# Altium schematic sheet 1_POWER.schdoc
size 307 x 218 mm; Symbol: A4空白; Device: A4空白; @Project Name: 34567890; @Page Count: 7; @Update Date: 2025-05-12; @Create Date: 2025-03-11; @Schematic Name: Schematic1; @Page No: 1; @Page Name: POWER; @Create Time: 07:05:34; @Board Name: PCB; @Update Time: 12:26:28; Title Block Position: 3; Width: 1170; Height: 825; Region Start: 1; X Region Count: 6; Y Region Count: 4; Blade Width: 10; SheetNumber: 1; SheetTotal: 7
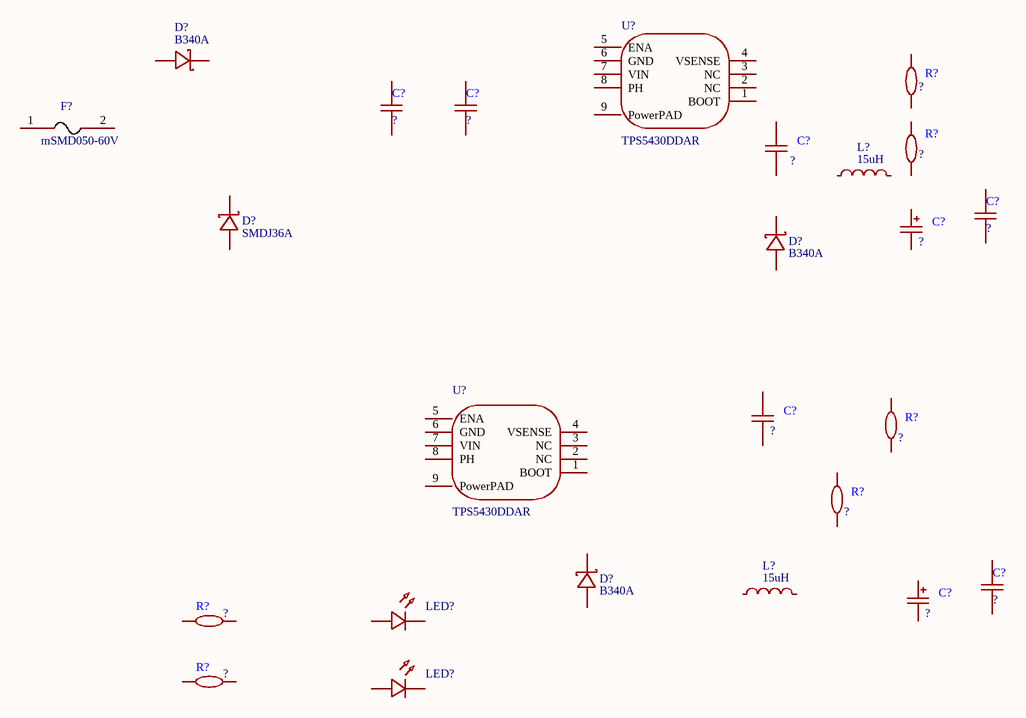
[diagram p0: 1_POWER.schdoc]

## Parts
(Parts that share a designator on the sheet are numbered #1, #2 ... from top to bottom, then left to right.)
C?#1  ?  [C0603]
C?#2  ?  [C0603]
C?#3  ?  [C0603]
C?#4  ?  [C0603]
C?#5  ?  [C_Ele_SMD_4x5.5mm]
C?#6  ?  [C0603]
C?#7  ?  [C0603]
C?#8  ?  [C_Ele_SMD_4x5.5mm]
D?#1  B340A  [SMA_L4.3-W2.6-LS5.2-RD]
D?#2  SMDJ36A  [SMC_L6.9-W5.9-LS7.9-RD]
D?#3  B340A  [SMA_L4.3-W2.6-LS5.2-RD]
D?#4  B340A  [SMA_L4.3-W2.6-LS5.2-RD]
F?  mSMD050-60V  [F1812]
L?#1  15uH  [IND-SMD_L7.1-W6.6_SLO0618H]
L?#2  15uH  [IND-SMD_L7.1-W6.6_SLO0618H]
LED?#1  (no value)  [LED_0603]
LED?#2  (no value)  [LED_0603]
R?#1  ?  [R0603]
R?#2  ?  [R0603]
R?#3  ?  [R0603]
R?#4  ?  [R0603]
R?#5  ?  [R0603]
R?#6  ?  [R0603]
U?#1  TPS5430DDAR  [ESOP-8_L4.9-W3.9-P1.27-LS6.0-TL-EP]
U?#2  TPS5430DDAR  [ESOP-8_L4.9-W3.9-P1.27-LS6.0-TL-EP]

## Nets

Not connected (* = marked no-connect by the designer): C?#1 1 2; C?#2 1 2; C?#3 1 2; C?#4 1 2; C?#5 1 2; C?#6 1 2; C?#7 1 2; C?#8 1 2; D?#1 1(K) 2(A); D?#2 1(K) 2(A); D?#3 1(K) 2(A); D?#4 1(K) 2(A); F? 1 2; L?#1 1 2; L?#2 1 2; LED?#1 1(C) 2(A); LED?#2 1(C) 2(A); R?#1 1 2; R?#2 1 2; R?#3 1 2; R?#4 1 2; R?#5 1 2; R?#6 1 2; U?#1 1(BOOT) 2(NC) 3(NC) 4(VSENSE) 5(ENA) 6(GND) 7(VIN) 8(PH) 9(PowerPAD); U?#2 1(BOOT) 2(NC) 3(NC) 4(VSENSE) 5(ENA) 6(GND) 7(VIN) 8(PH) 9(PowerPAD)

## Notes on the sheet
- 1
- 2
- 3
- 4
- 5
- 6
- A
- B
- C
- D

## Library data of the parts
C?#1-C?#4 C?#6 C?#7 = CAP_0603: Device: CAP_0603
C?#5 C?#8 = C_Ele_SMD_4x5.5mm: Device: C_Ele_SMD_4x5.5mm
L?#1 L?#2 = SLO0630H150MTT: Device: SLO0630H150MTT
LED?#1 LED?#2 = LED_0603-R: Device: LED_0603-R
R?#1-R?#6 = Res_0603: Device: Res_0603
D?#1 D?#3 D?#4 = B340A: Device: B340A
D?#2 = SMDJ36A: Device: SMDJ36A
F? = mSMD050-60V: Device: mSMD050-60V
U?#1 U?#2 = TPS5430DDAR: Device: TPS5430DDAR